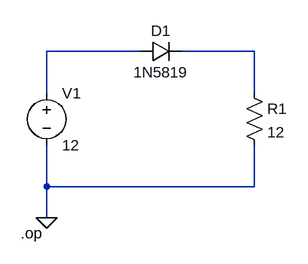
[diagram p0: schematic schematic 1N5819 - 12V.asc]
schematic 1N5819 - 12V.asc, the LTspice schematic file:
Version 4.1
SHEET 1 880 680
WIRE 192 80 48 80
WIRE 368 80 256 80
WIRE 48 144 48 80
WIRE 368 144 368 80
WIRE 48 288 48 224
WIRE 368 288 368 224
WIRE 368 288 48 288
WIRE 48 336 48 288
FLAG 48 336 0
SYMBOL voltage 48 128 R0
WINDOW 123 0 0 Left 0
WINDOW 39 0 0 Left 0
SYMATTR InstName V1
SYMATTR Value 12
SYMBOL diode 192 96 R270
WINDOW 0 32 32 VTop 2
WINDOW 3 0 32 VBottom 2
SYMATTR InstName D1
SYMATTR Value 1N5819
SYMATTR Description Diode
SYMATTR Type diode
SYMBOL res 352 128 R0
SYMATTR InstName R1
SYMATTR Value 12
TEXT 8 360 Left 2 !.op

The netlist it stands for:
* schematic 1N5819 - 12V.asc
V1 N001 0 12
D1 N001 N002 1N5819
R1 N002 0 12
.model D D
.lib standard.dio
.op
.backanno
.end